# Altium schematic sheet tms320f28388d_core_board_power.SchDoc
size A3; SheetNumber: 4; SheetTotal: 5
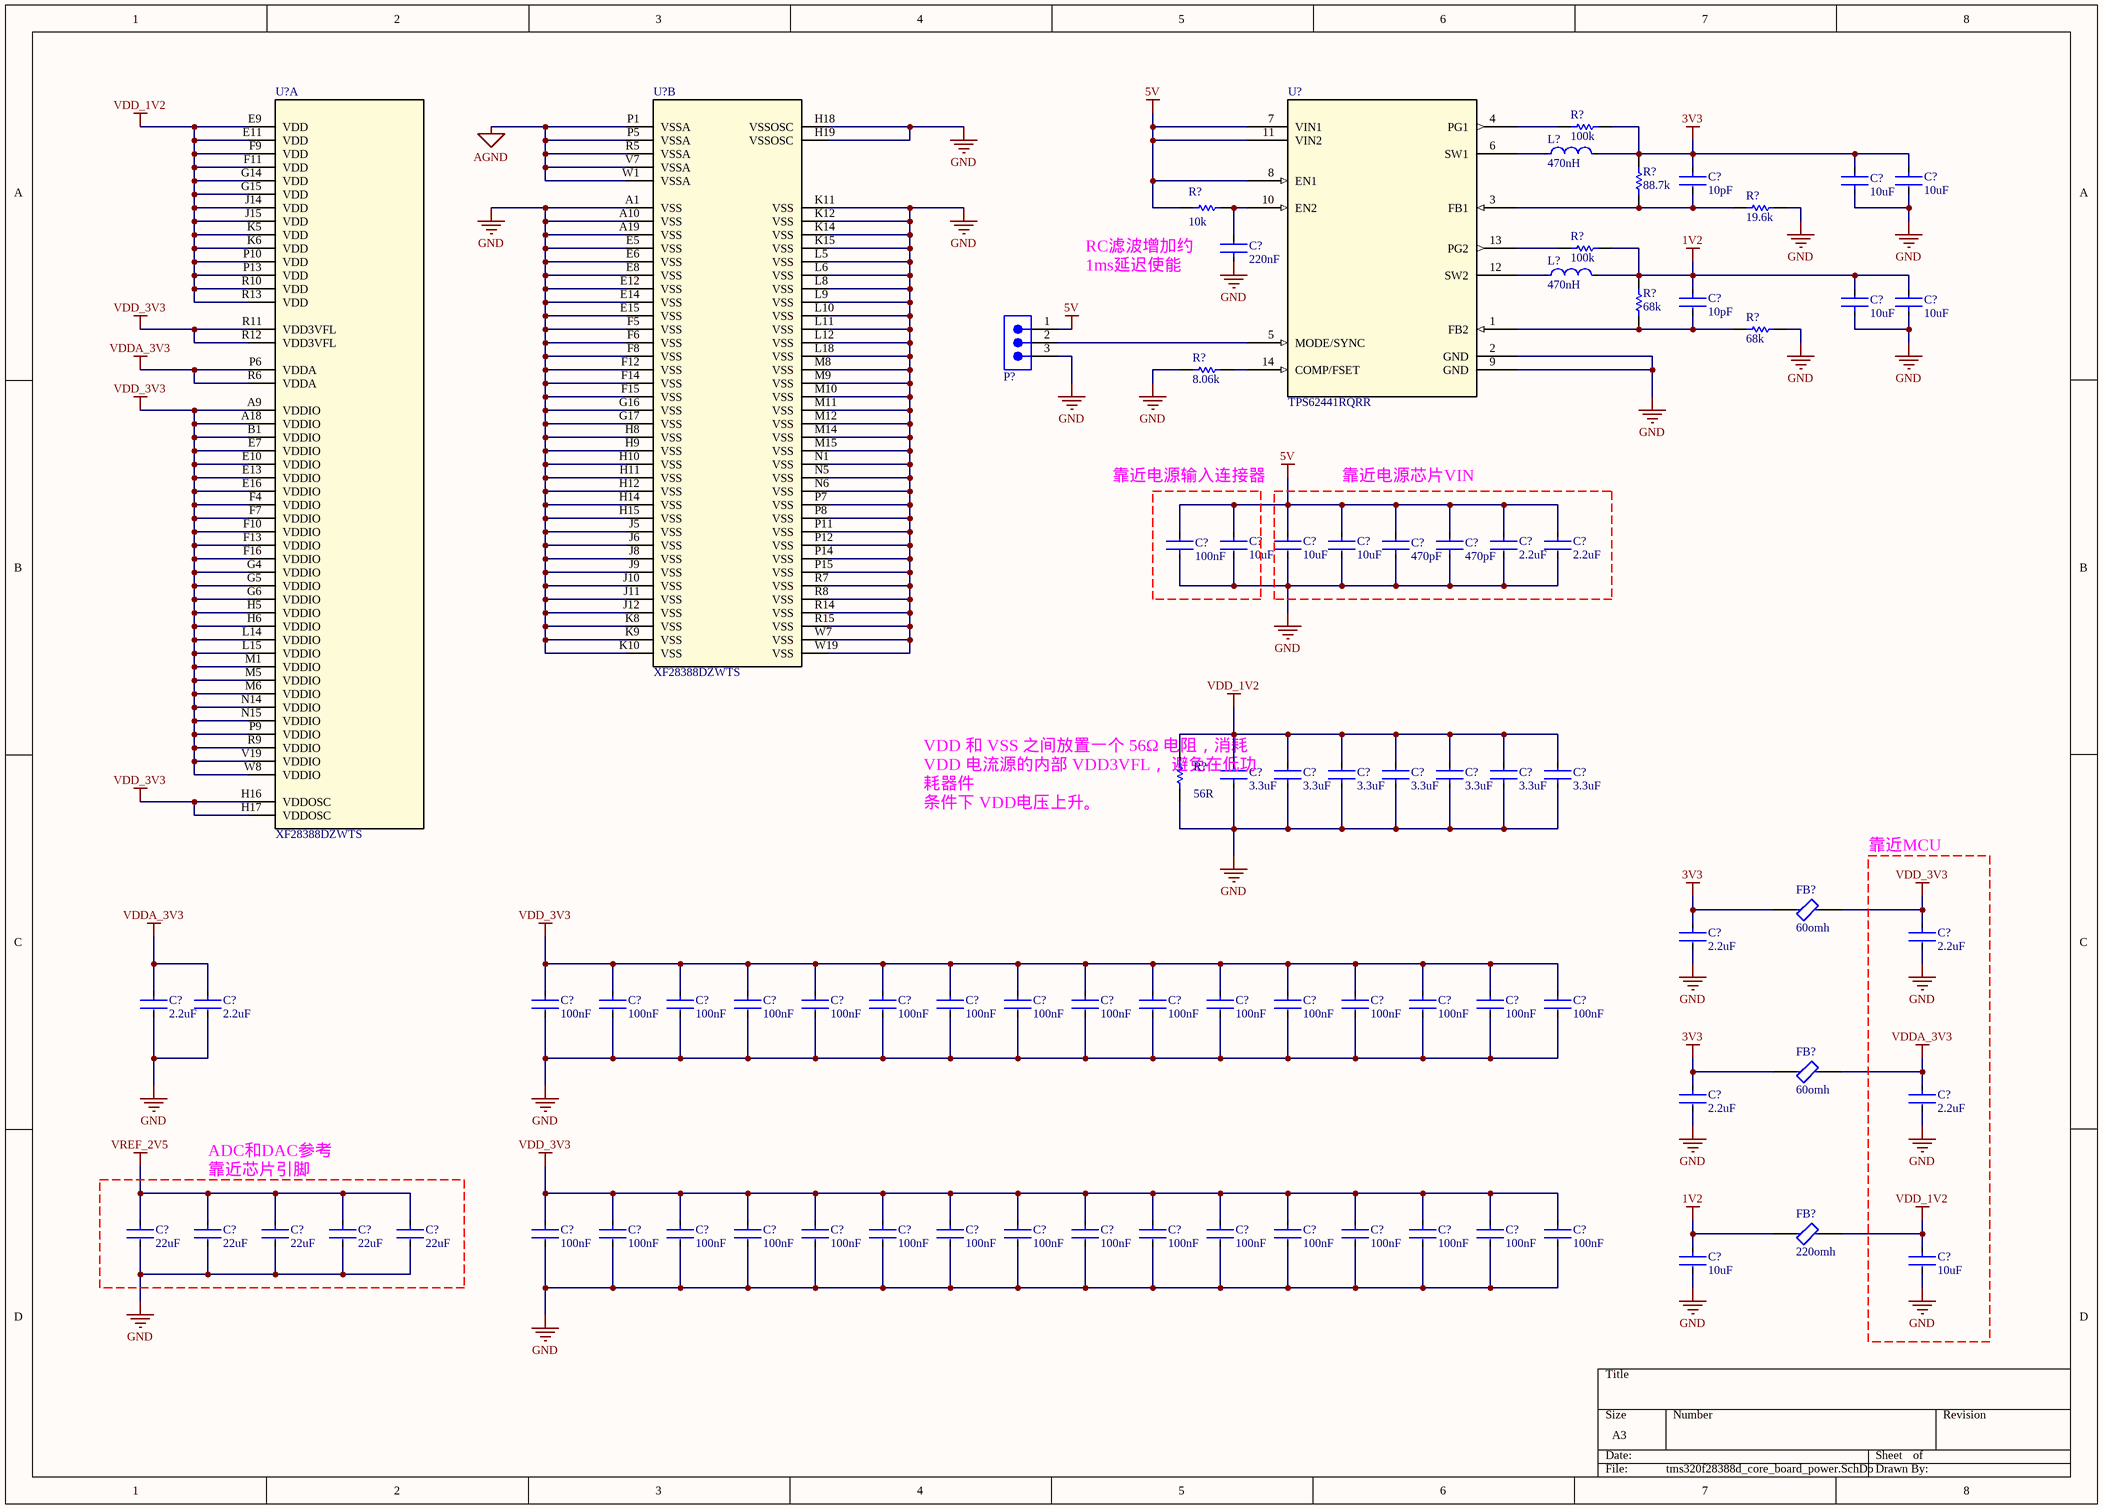
[diagram p0: tms320f28388d_core_board_power.SchDoc]

## Parts
(Parts that share a designator on the sheet are numbered #1, #2 ... from top to bottom, then left to right.)
C?#1  10pF  [FP-GCM155-0_05-MFG]
C?#2  10uF  [FP-GRM188-0_2-MFG]
C?#3  10uF  [FP-GRM188-0_2-MFG]
C?#4  220nF  [FP-GRM155-0_05-MFG]
C?#5  10pF  [FP-GCM155-0_05-MFG]
C?#6  10uF  [FP-GRM188-0_2-MFG]
C?#7  10uF  [FP-GRM188-0_2-MFG]
C?#8  10uF  [FP-GRM188-0_2-MFG]
C?#9  10uF  [FP-GRM188-0_2-MFG]
C?#10  10uF  [FP-GRM188-0_2-MFG]
C?#11  2.2uF  [FP-GRM188-0_1-e0_2_0_5-MFG]
C?#12  2.2uF  [FP-GRM188-0_1-e0_2_0_5-MFG]
C?#13  100nF  [FP-CC0402-MFG]
C?#14  470pF  [FP-0402-L_1_0_1-W_0_5_0_1-MFG]
C?#15  470pF  [FP-0402-L_1_0_1-W_0_5_0_1-MFG]
C?#16  3.3uF  [FP-CC0402-MFG]
C?#17  3.3uF  [FP-CC0402-MFG]
C?#18  3.3uF  [FP-CC0402-MFG]
C?#19  3.3uF  [FP-CC0402-MFG]
C?#20  3.3uF  [FP-CC0402-MFG]
C?#21  3.3uF  [FP-CC0402-MFG]
C?#22  3.3uF  [FP-CC0402-MFG]
C?#23  2.2uF  [FP-CC0402-MFG]
C?#24  2.2uF  [FP-CC0402-MFG]
C?#25  2.2uF  [FP-CC0402-MFG]
C?#26  2.2uF  [FP-CC0402-MFG]
C?#27  100nF  [FP-CC0402-MFG]
C?#28  100nF  [FP-CC0402-MFG]
C?#29  100nF  [FP-CC0402-MFG]
C?#30  100nF  [FP-CC0402-MFG]
C?#31  100nF  [FP-CC0402-MFG]
C?#32  100nF  [FP-CC0402-MFG]
C?#33  100nF  [FP-CC0402-MFG]
C?#34  100nF  [FP-CC0402-MFG]
C?#35  100nF  [FP-CC0402-MFG]
C?#36  100nF  [FP-CC0402-MFG]
C?#37  100nF  [FP-CC0402-MFG]
C?#38  100nF  [FP-CC0402-MFG]
C?#39  100nF  [FP-CC0402-MFG]
C?#40  100nF  [FP-CC0402-MFG]
C?#41  100nF  [FP-CC0402-MFG]
C?#42  100nF  [FP-CC0402-MFG]
C?#43  2.2uF  [FP-CC0402-MFG]
C?#44  2.2uF  [FP-CC0402-MFG]
C?#45  22uF  [FP-GRM158-0_2-MFG]
C?#46  22uF  [FP-GRM158-0_2-MFG]
C?#47  22uF  [FP-GRM158-0_2-MFG]
C?#48  22uF  [FP-GRM158-0_2-MFG]
C?#49  22uF  [FP-GRM158-0_2-MFG]
C?#50  100nF  [FP-CC0402-MFG]
C?#51  100nF  [FP-CC0402-MFG]
C?#52  100nF  [FP-CC0402-MFG]
C?#53  100nF  [FP-CC0402-MFG]
C?#54  100nF  [FP-CC0402-MFG]
C?#55  100nF  [FP-CC0402-MFG]
C?#56  100nF  [FP-CC0402-MFG]
C?#57  100nF  [FP-CC0402-MFG]
C?#58  100nF  [FP-CC0402-MFG]
C?#59  100nF  [FP-CC0402-MFG]
C?#60  100nF  [FP-CC0402-MFG]
C?#61  100nF  [FP-CC0402-MFG]
C?#62  100nF  [FP-CC0402-MFG]
C?#63  100nF  [FP-CC0402-MFG]
C?#64  100nF  [FP-CC0402-MFG]
C?#65  100nF  [FP-CC0402-MFG]
C?#66  10uF  [FP-CC0402-MFG]
C?#67  10uF  [FP-CC0402-MFG]
FB?#1  60omh  [FP-BLM15-0_05-d0_7-MFG]
FB?#2  60omh  [FP-BLM15-0_05-d0_7-MFG]
FB?#3  220omh  [FP-BLM15-0_05-MFG]
L?#1  470nH  [FP-DFE252012C-MFG]
L?#2  470nH  [FP-DFE252012C-MFG]
P?  TSW-103-07-G-S  [SMTC-TSW-103-07-X-S]  (value not drawn)
R?#1  100k  [RESC1005X40X25NL05T10]
R?#2  88.7k  [RESC1005X40X25NL05T05]
R?#3  19.6k  [RESC1005X40X25NL05T05]
R?#4  10k  [FP-RT0402-MFG]
R?#5  100k  [RESC1005X40X25NL05T10]
R?#6  68k  [RESC1005X40X25NL05T05]
R?#7  68k  [RESC1005X40X25NL05T05]
R?#8  8.06k  [RESC1005X40X25NL05T05]
R?#9  56R  [FP-RT0402-MFG]
U?#1  XF28388DZWTS  [ZWT0337A-MFG]  (part A of 8)
U?#2  XF28388DZWTS  [ZWT0337A-MFG]  (part B of 8)
U?#3  TPS62441RQRR  [VQFN-HR14_RQR_TEX]

## Nets
1V2: C?#5.1 C?#6.2 C?#7.2 C?#66.1 FB?#3.1 L?#2.2 R?#5.1 R?#6.2
3V3: C?#1.1 C?#2.1 C?#3.2 C?#23.1 C?#43.1 FB?#1.1 FB?#2.1 L?#1.2 R?#1.1 R?#2.2
5V: C?#8.1 C?#9.1 C?#10.1 C?#11.1 C?#12.1 C?#13.2 C?#14.2 C?#15.2 P?.1 R?#4.2 U?#3.7(VIN1) U?#3.8(EN1) U?#3.11(VIN2)
AGND: U?#2.P1(VSSA) U?#2.P5(VSSA) U?#2.R5(VSSA) U?#2.V7(VSSA) U?#2.W1(VSSA)
GND: C?#2.2 C?#3.1 C?#4.1 C?#6.1 C?#7.1 C?#8.2 C?#9.2 C?#10.2 C?#11.2 C?#12.2 C?#13.1 C?#14.1 C?#15.1 C?#16.1 C?#17.1 C?#18.1 C?#19.1 C?#20.1 C?#21.1 C?#22.1 C?#23.2 C?#24.2 C?#25.2 C?#26.2 C?#27.2 C?#28.2 C?#29.2 C?#30.2 C?#31.2 C?#32.2 C?#33.2 C?#34.2 C?#35.2 C?#36.2 C?#37.2 C?#38.2 C?#39.2 C?#40.2 C?#41.2 C?#42.2 C?#43.2 C?#44.2 C?#45.2 C?#46.2 C?#47.2 C?#48.2 C?#49.2 C?#50.2 C?#51.2 C?#52.2 C?#53.2 C?#54.2 C?#55.2 C?#56.2 C?#57.2 C?#58.2 C?#59.2 C?#60.2 C?#61.2 C?#62.2 C?#63.2 C?#64.2 C?#65.2 C?#66.2 C?#67.2 P?.3 R?#3.2 R?#7.2 R?#8.2 R?#9.2 U?#2.A1(VSS) U?#2.A10(VSS) U?#2.A19(VSS) U?#2.E5(VSS) U?#2.E6(VSS) U?#2.E8(VSS) U?#2.E12(VSS) U?#2.E14(VSS) U?#2.E15(VSS) U?#2.F5(VSS) U?#2.F6(VSS) U?#2.F8(VSS) U?#2.F12(VSS) U?#2.F14(VSS) U?#2.F15(VSS) U?#2.G16(VSS) U?#2.G17(VSS) U?#2.H8(VSS) U?#2.H9(VSS) U?#2.H10(VSS) U?#2.H11(VSS) U?#2.H12(VSS) U?#2.H14(VSS) U?#2.H15(VSS) U?#2.H18(VSSOSC) U?#2.H19(VSSOSC) U?#2.J5(VSS) U?#2.J6(VSS) U?#2.J8(VSS) U?#2.J9(VSS) U?#2.J10(VSS) U?#2.J11(VSS) U?#2.J12(VSS) U?#2.K8(VSS) U?#2.K9(VSS) U?#2.K10(VSS) U?#2.K11(VSS) U?#2.K12(VSS) U?#2.K14(VSS) U?#2.K15(VSS) U?#2.L5(VSS) U?#2.L6(VSS) U?#2.L8(VSS) U?#2.L9(VSS) U?#2.L10(VSS) U?#2.L11(VSS) U?#2.L12(VSS) U?#2.L18(VSS) U?#2.M8(VSS) U?#2.M9(VSS) U?#2.M10(VSS) U?#2.M11(VSS) U?#2.M12(VSS) U?#2.M14(VSS) U?#2.M15(VSS) U?#2.N1(VSS) U?#2.N5(VSS) U?#2.N6(VSS) U?#2.P7(VSS) U?#2.P8(VSS) U?#2.P11(VSS) U?#2.P12(VSS) U?#2.P14(VSS) U?#2.P15(VSS) U?#2.R7(VSS) U?#2.R8(VSS) U?#2.R14(VSS) U?#2.R15(VSS) U?#2.W7(VSS) U?#2.W19(VSS) U?#3.2(GND) U?#3.9(GND)
VDD_1V2: C?#16.2 C?#17.2 C?#18.2 C?#19.2 C?#20.2 C?#21.2 C?#22.2 C?#67.1 FB?#3.2 R?#9.1 U?#1.E9(VDD) U?#1.E11(VDD) U?#1.F9(VDD) U?#1.F11(VDD) U?#1.G14(VDD) U?#1.G15(VDD) U?#1.J14(VDD) U?#1.J15(VDD) U?#1.K5(VDD) U?#1.K6(VDD) U?#1.P10(VDD) U?#1.P13(VDD) U?#1.R10(VDD) U?#1.R13(VDD)
VDD_3V3: C?#24.1 C?#27.1 C?#28.1 C?#29.1 C?#30.1 C?#31.1 C?#32.1 C?#33.1 C?#34.1 C?#35.1 C?#36.1 C?#37.1 C?#38.1 C?#39.1 C?#40.1 C?#41.1 C?#42.1 C?#50.1 C?#51.1 C?#52.1 C?#53.1 C?#54.1 C?#55.1 C?#56.1 C?#57.1 C?#58.1 C?#59.1 C?#60.1 C?#61.1 C?#62.1 C?#63.1 C?#64.1 C?#65.1 FB?#1.2 U?#1.A9(VDDIO) U?#1.A18(VDDIO) U?#1.B1(VDDIO) U?#1.E7(VDDIO) U?#1.E10(VDDIO) U?#1.E13(VDDIO) U?#1.E16(VDDIO) U?#1.F4(VDDIO) U?#1.F7(VDDIO) U?#1.F10(VDDIO) U?#1.F13(VDDIO) U?#1.F16(VDDIO) U?#1.G4(VDDIO) U?#1.G5(VDDIO) U?#1.G6(VDDIO) U?#1.H5(VDDIO) U?#1.H6(VDDIO) U?#1.H16(VDDOSC) U?#1.H17(VDDOSC) U?#1.L14(VDDIO) U?#1.L15(VDDIO) U?#1.M1(VDDIO) U?#1.M5(VDDIO) U?#1.M6(VDDIO) U?#1.N14(VDDIO) U?#1.N15(VDDIO) U?#1.P9(VDDIO) U?#1.R9(VDDIO) U?#1.R11(VDD3VFL) U?#1.R12(VDD3VFL) U?#1.V19(VDDIO) U?#1.W8(VDDIO)
VDDA_3V3: C?#25.1 C?#26.1 C?#44.1 FB?#2.2 U?#1.P6(VDDA) U?#1.R6(VDDA)
VREF_2V5: C?#45.1 C?#46.1 C?#47.1 C?#48.1 C?#49.1
NetC?#1_2: C?#1.2 R?#2.1 R?#3.1 U?#3.3(FB1)
NetC?#4_2: C?#4.2 R?#4.1 U?#3.10(EN2)
NetC?#5_2: C?#5.2 R?#6.1 R?#7.1 U?#3.1(FB2)
NetL?#1_1: L?#1.1 U?#3.6(SW1)
NetL?#2_1: L?#2.1 U?#3.12(SW2)
NetP?_2: P?.2 U?#3.5(MODE/SYNC)
NetR?#1_2: R?#1.2 U?#3.4(PG1)
NetR?#5_2: R?#5.2 U?#3.13(PG2)
NetR?#8_1: R?#8.1 U?#3.14(COMP/FSET)

## Notes on the sheet
- RC滤波增加约1ms延迟使能
- (near C?#13) 靠近电源输入连接器
- (near C?#14) 靠近电源芯片VIN
- VDD 和 VSS 之间放置一个 56Ω 电阻，消耗 VDD 电流源的内部 VDD3VFL， 避免在低功耗器件
  条件下 VDD电压上升。
- 靠近MCU
- (near C?#46) ADC和DAC参考靠近芯片引脚

## Library data of the parts
C?#1 C?#5 = GCM1555C1H100JA16D: Ceramic Capacitor for Automotive 10pF ±5% 50VDC C0G 0402 Paper T/R; Voltage Rating: 50V; Case/Package: 0402; Dielectric: C0G; Package Quantity: 10000; Ratings: AEC-Q200; Max Operating Temperature: 125°C; Width: 0.02inch; REACH SVHC: No SVHC; Mount: Surface Mount; Min Operating Temperature: -55°C; Lead Free: Lead Free; Packaging: Tape and Reel; Capacitance: 10pF; Case Code (Imperial): 0402; Tolerance: 5%; Height: 0.5mm; Thickness: 0.022inch; Length: 0.039inch; Case Code (Metric): 1005; Weight: 0.000212oz; Voltage Rating (DC): 50V; Termination: SMD/SMT
C?#2 C?#3 C?#6-C?#10 = GRM188Z71A106MA73D: Chip Multilayer Ceramic Capacitors for General Purpose, 0603, 10uF, X7R, 15%, 20%, 10V; Case/Package: 0603
C?#4 = GRM155R61H224KE01D: Multilayer Ceramic Capacitor 0.22uF 10% 50V X5R 0402 Paper T/R
C?#11 C?#12 = GRM188C70J225KE20D: Chip Multilayer Ceramic Capacitors for General Purpose, 0603, 2.2uF, X7S, 22%, 10%, 6.3V; Thickness: 0.035inch; Length: 1.6mm; Packaging: Tape and Reel; Tolerance: 10%; Number of Pins: 2; Depth: 0.8mm; Voltage Rating: 6.3V; Voltage Rating (DC): 6.3V; Lead Pitch: 0.5mm; Dielectric: X7S; Case Code (Imperial): 0603; Weight: 7.1E-05oz; Min Operating Temperature: -55°C; Width: 0.031inch; Termination: SMD/SMT; Height: 0.8mm; REACH SVHC: No SVHC; Radiation Hardening: No; Case Code (Metric): 1608; Mount: Surface Mount; Package Quantity: 4000; Max Operating Temperature: 125°C; Case/Package: 0603; Capacitance: 2.2uF
C?#13 C?#27-C?#42 C?#50-C?#65 = CC0402KRX7R7BB104: CAP CER 0.1UF 16V X7R 0402; Manufacturer: YAGEO; Material: Ceramic; Automotive Grade: NA; Temperature Coefficient: 30ppm/°C; Tolerance: 0.1; Device Class L1: Passive Components; Temperature Range Low: -55°C; Device Class L3: Ceramic Capacitors; Temperature Characteristic: X7R; Ipc Land Pattern Name: CAPC10050X50; Capacitance: 100 nF; Temperature Range High: +125°C; Voltage Rating: 16 V; Temperature: -55°C to +125°C; RoHS: TRUE; Automotive: No; Height: 0.55mm; Device Class L2: Capacitors; Digikey Description: CAP CER 0.1UF 16V X7R 0402; Package: CC0402; Footprint Url: http://www.yageo.com/exep/pages/download/literatures/UPY-C_GEN_24.pdf; ComponentLink2Description: Datasheet; Category: Cap; Lead Free: Yes; Value: 100 nF; Octopart: https://octopart.com/cc0402krx7r7bb104-yageo-42244624; ComponentLink2URL: http://www.yageo.com/documents/recent/UPY-GP_NP0_16V-to-50V_16.pdf; Manufacturer Part Number: CC0402KRX7R7BB104; Mouser Description: 0402 0.1 uF 16 V ±10 % Tolerance X7R SMT Multilayer Ceramic Capacitor
C?#14 C?#15 = CC0402KRX7R9BB471: General Purpose Ceramic Capacitor, 0402, 470pF, 10%, X7R, 15%, 50V; Series: -; Height: 0.5mm; Termination: SMD/SMT; Packaging: Tape and Reel; Tolerance: 10%; REACH SVHC: No SVHC; Package Quantity: 10000; Case Code (Imperial): 0402; Voltage: 50V; Depth: 0.5mm; Case Code (Metric): 1005; Voltage Rating: 50V; Radiation Hardening: No; Construction: Flat; Mount: Surface Mount; Dielectric: X7R; Min Operating Temperature: -55°C; Width: 0.5mm; Number of Pins: 2; Case/Package: 0402; RoHS Compliant: Yes; Thickness: 0.022inch; Lead Free: Lead Free; Voltage Rating (DC): 50V; Max Operating Temperature: 125°C; Capacitance: 470pF; Length: 1mm; Contact Plating: Tin
C?#16-C?#22 = C0402C335M7PACTU: Manufacturer: Kemet; Part Number: C0402C335M7PACTU
C?#23-C?#26 C?#43 C?#44 = CC0402KRX5R6BB225: CAP CER 2.2UF 10V X5R 0402; Manufacturer: YAGEO; Automotive Grade: NA; Temperature Coefficient: 30ppm/°C; Tolerance: 0.1; Material: Ceramic; Automotive: No; Device Class L1: Passive Components; Footprint Url: http://www.yageo.com/exep/pages/download/literatures/UPY-C_GEN_24.pdf; Height: 0.55mm; Temperature Range High: +125°C; Category: Cap; ComponentLink2Description: Datasheet; Lead Free: Yes; Octopart: https://octopart.com/cc0402krx5r6bb225-yageo-30987418; Value: 2.2 uF; Ipc Land Pattern Name: CAPC10050X50; Device Class L3: Ceramic Capacitors; Temperature Characteristic: X5R; Device Class L2: Capacitors; Package: CC0402; RoHS: TRUE; Capacitance: 2.2 uF; Temperature: -55°C to +125°C; Digikey Description: CAP CER 2.2UF 10V X5R 0402; Mouser Description: CC Series 0402 2.2 uF 10 V ±10% Tolerance X5R Multilayer Ceramic Capacitor; Voltage Rating: 10 V; Manufacturer Part Number: CC0402KRX5R6BB225; ComponentLink2URL: http://www.yageo.com/documents/recent/UPY-GP_NP0_16V-to-50V_16.pdf; Temperature Range Low: -55°C
C?#45-C?#49 = GRM158C80G226ME01D: Chip Multilayer Ceramic Capacitors for General Purpose, 0402, 22uF, X6S, 22%, 20%, 4V
C?#66 C?#67 = CL05A106MP5NUNC: CAP CER 10UF 10V X5R 0402; Manufacturer: Samsung; Temperature Coefficient: 15%; Tolerance: 20%; Material: Ceramic; Octopart: https://octopart.com/cl05a106mp5nunc-samsung-22457395; Voltage Rating: 10V; RoHS: TRUE; Value: 10uF; Height: 0.7mm; Digikey Description: CAP CER 10UF 10V X5R 0402; Automotive: No; Package: CL05A106MP5NUNC; Device Class L1: Passive Components; Capacitance: 10uF; Temperature Range High: +85°C; ComponentLink2Description: Datasheet; Device Class L2: Capacitors; Temperature Characteristic: X5R; Manufacturer Part Number: CL05A106MP5NUNC; Temperature: -55°C to +85°C; ComponentLink2URL: http://www.samsungsem.com/kr/support/product-search/mlcc/__icsFiles/afieldfile/2019/05/10/19-CL05A106MP5NUNC.pdf; Device Class L3: Ceramic Capacitors; Category: Cap; Temperature Range Low: -55°C; Ipc Land Pattern Name: CAPC10050X50; Lead Free: Yes
FB?#1 FB?#2 = BLM15PD600SN1D: Chip Ferrite Bead, 0402, 60Ω @ 100MHz, 0.06Ω, 25%, 1.7A; Number of Circuits: 1; DC Resistance (DCR): 60mR; Material: Steel; Impedance: 60R; Test Frequency: 100MHz; Lead Free: Lead Free; Radiation Hardening: No; Min Operating Temperature: -55°C; Case Code (Metric): 1005; Series: BLM15PD; Max Current Rating: 1.7A; Length: 1mm; Tolerance: 25%; Current Rating: 1.7A; RoHS Compliant: Yes; DC Current: 1.7A; Width: 0.5mm; Core Material: Ferrite; Number of Pins: 2; Depth: 0.55mm; Case Code (Imperial): 0402; Number of Lines: 1; Package Quantity: 1; Max Operating Temperature: 125°C; Case/Package: 0402; Termination: SMD/SMT; Packaging: Tape and Reel; Height: 0.5mm; Military Standard: Not; REACH SVHC: No SVHC; Max DC Current: 1.7A; DC Resistance-Max: 60MR
FB?#3 = BLM15AG221SN1D: Chip Ferrite Bead, 0402, 220Ω @ 100MHz, 0.29Ω, 25%, 450mA; Impedance: 220R; Shielding: Unshielded; Number of Lines: 1; DC Resistance (DCR): 290mR; DC Current: 300mA; Resistance: 350mR; Material: Steel; Radiation Hardening: No; Number of Pins: 2; REACH SVHC: No SVHC; Min Operating Temperature: -55°C; Width: 0.5mm; Lead Free: Lead Free; Case/Package: 0402; Case Code (Imperial): 0402; Max Current Rating: 450mA; Max Operating Temperature: 125°C; Length: 1mm; Tolerance: 25%; Current Rating: 450mA; Core Material: Ferrite; Depth: 0.55mm; Max DC Current: 300mA; Military Standard: Not; Termination: SMD/SMT; Height: 0.5mm; Packaging: Tape and Reel; Package Quantity: 1; Test Frequency: 100MHz; Number of Circuits: 1; RoHS Compliant: Yes; Case Code (Metric): 1005
L?#1 L?#2 = DFE252012P-R47M=P2: Shielded Wirewound Inductor 0.47uH 20% 4000mA 0.027Ω 1008 (2520); Test Frequency: 1MHz; Max DC Current: 4A; DC Resistance (DCR): 27mR; Core Material: Ferrite; Current Rating: 5.7A; Min Operating Temperature: -40°C; Depth: 2mm; Case/Package: 1008; Width: 0.079inch; Length: 0.098inch; Max Operating Temperature: 125°C; Tolerance: 20%; Case Code (Imperial): 1008; Mount: Surface Mount; Inductance: 470nH; Packaging: Tape and Reel; Height - Seated (Max): 0.039inch; Case Code (Metric): 2520; Resistor Type: Wirewound; Shielding: Shielded
P? = TSW-103-07-G-S: 0.025" SQ Post Header, Through-hole, Vertical, -55 to 125 degC, 2.54 mm Pitch, 3-Pin, Male, RoHS; Manufacturer: Samtec; Pitch: 2.54 mm; ComponentLink3URL: http://www.samtec.com/documents/webfiles/cpdf/TSW-XXX-XX-XXX-X-XX-XXX-MKT.pdf; Temperature Range: -55 to 125 degC; DatasheetVersion: F-214; ComponentLink1Description: Manufacturer URL; ComponentLink2URL: http://www.samtec.com/documents/webfiles/pdf/TSW_TH.PDF; RoHS: True; Orientation: Vertical; ComponentLink2Description: Datasheet; ComponentLink3Description: Package Specification; PackageDescription: .025[0.64] SQ. Post Terminal Strip Assembly; Mounting Technology: Through-hole; PackageVersion: DM, 8/1988; ComponentLink1URL: http://www.samtec.com; PackageReference: TSW-103-07-X-S; PartNumber: TSW-103-07-G-S
R?#1 R?#5 = RC0402FR-07100KL: Manufacturer: Yageo / Phycomp; Part Number: RC0402FR-07100KL
R?#2 = ERJ-2RKF8872X: Manufacturer: Panasonic; Part Number: ERJ-2RKF8872X
R?#3 = ERJ2RKF1962X: Manufacturer: Panasonic; Part Number: ERJ-2RKF8872X
R?#4 = RC0402FR-0710KL: Manufacturer: Yageo / Phycomp; Part Number: RC0402FR-0710KL
R?#6 R?#7 = ERJ2RKF6802X: Manufacturer: Panasonic; Part Number: ERJ-2RKF8872X
R?#8 = ERJ-2RKF8061X: Manufacturer: Panasonic; Part Number: ERJ-2RKF8061X
R?#9 = RT0402BRD0756RL: RES SMD 56 OHM 0.1% 1/16W 0402; Manufacturer: Yageo; Power Rating: 0.063W; Resistance: 56Ω; Tolerance: 0.001; Value: 56Ω; Voltage Rating: 50V; Temperature Coefficient: 25 ppm/°C; Octopart: https://octopart.com/rt0402brd0756rl-yageo-1266468; Footprint Url: http://www.yageo.com/exep/pages/download/literatures/PYu-R_Mount_10.pdf; Mouser Description: Thin Film Resistors 1/16W 56 ohm .1% 25ppm; ComponentLink2URL: http://www.yageo.com/documents/recent/PYu-RT_1-to-0.01_RoHS_L_9.pdf; Category: Res; Temperature Range Low: -55°C; Device Class L2: Resistors; Series: RT; Digikey Description: RES SMD 56 OHM 0.1% 1/16W 0402; Device Class L3: Chip SMD Resistors; Composition: Thin Film; ComponentLink2Description: Datasheet; Temperature: -55°C to +155°C; Manufacturer Part Number: RT0402BRD0756RL; RoHS: TRUE; Lead Free: Yes; Package: RT0402; Temperature Range High: +155°C; Height: 0.35mm; Device Class L1: Passive Components; Ipc Land Pattern Name: RESC10050X30; Automotive: No
U?#1 U?#2 = XF28388DZWTS: C2000 32-bit MCU w/ connectivity manager, 2x C28x+CLA CPU, 1.5 MB flash, FPU64, CLB, ENET, EtherCAT 337-NFBGA -40 to 125; Manufacturer_Name: Texas Instruments; TYPE: TYPE; RefDes: RefDes; Copyright: Copyright (C) 2026 Ultra Librarian. All rights reserved.; Manufacturer_Part_Number: XF28388DZWTS
U?#3 = TPS62441RQRR: 2.75-V to 6-V, dual 1-A step-down converter in QFN package 14-VQFN-HR -40 to 150; Manufacturer_Name: Texas Instruments; Type: Power Management; Copyright: Copyright (C) 2026 Ultra Librarian. All rights reserved.; Manufacturer_Part_Number: TPS62441RQRR; RefDes: RefDes